# EasyEDA schematic SCH_Genie-V1_2024-08-01.json
TITLE: Sheet_1; REV: 1.0; Date: 2024-07-29; Sheet: 1/1; Drawn By: usedgenes; Company: Your Company
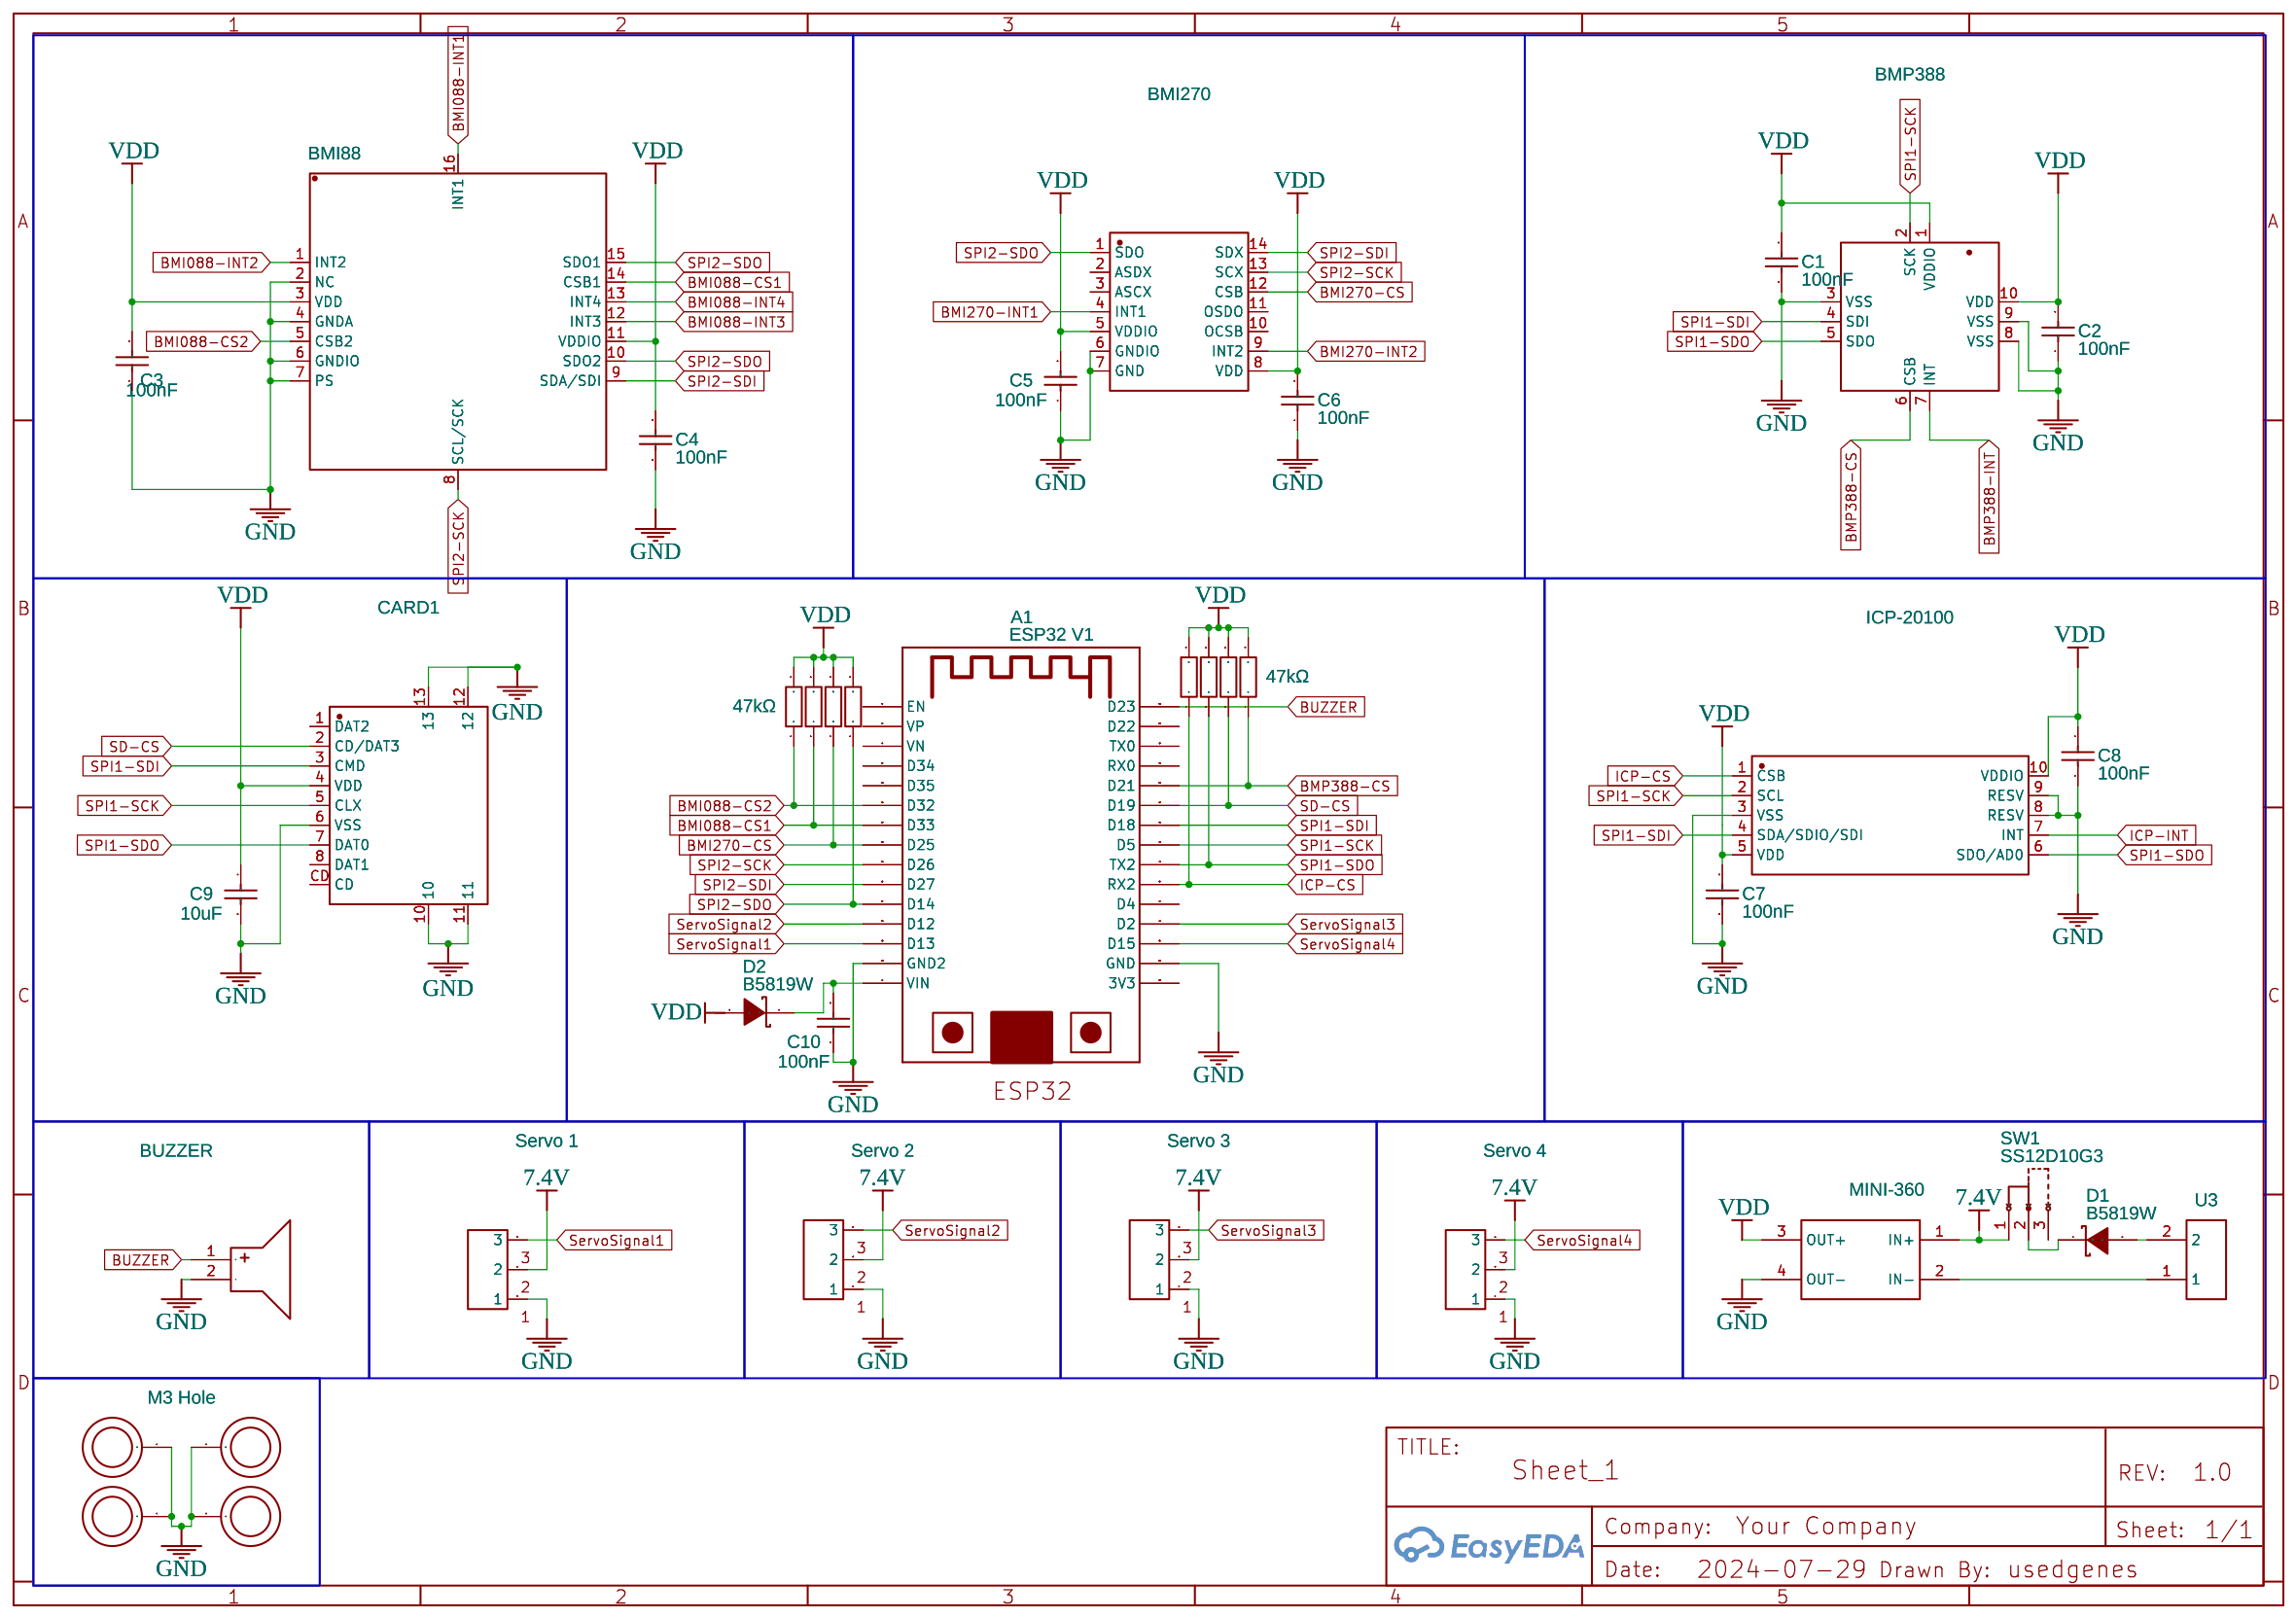
[diagram p0: schematic sheet]

## Parts
A1  ESP32 V1  [ESP32-DEVKITV1_ESP32-DEVKITV1]
BMI88  BMI088  [LGA-16_L4.5-W3.0-P0.50-BL]
BMI270  BMI270  [LGA-14_L3.0-W2.5-P0.50-BR]
BMP388  BMP388  [SENSORM-SMD_BMP388]
BUZZER  4000Hz  [BUZ-TH_BD14.0-P7.60-D1.0-L]
C1  100nF  [C0402]
C2  100nF  [C0402]
C3  100nF  [C0402]
C4  100nF  [C0402]
C5  100nF  [C0402]
C6  100nF  [C0402]
C7  100nF  [C0402]
C8  100nF  [C0402]
C9  10uF  [C0402]
C10  100nF  [C0402]
CARD1  TF PUSH  [TF-SMD_TF-PUSH]
D1  B5819W  [SOD-123_L2.8-W1.8-LS3.7-RD]
D2  B5819W  [SOD-123_L2.8-W1.8-LS3.7-RD]
H1  M3 Hole  [HOLEHOLE]
H2  3MM_HOLE  [HOLEHOLE]
H3  3MM_HOLE  [HOLEHOLE]
H4  3MM_HOLE  [HOLEHOLE]
ICP-20100  ICP-20100  [LGA-10_L2.0-W2.0-P0.50-TL_ICP-20100]
MINI-360  MINI-360  [DSN-MINI-360]
P1  Servo 1  [CONNECTOR_PINHEADER_2.54MM:PINHEADER_1X3]
P2  Servo 2  [CONNECTOR_PINHEADER_2.54MM:PINHEADER_1X3]
P3  Servo 3  [CONNECTOR_PINHEADER_2.54MM:PINHEADER_1X3]
P4  Servo 4  [CONNECTOR_PINHEADER_2.54MM:PINHEADER_1X3]
R1  47kΩ  [R0402]
R2  47kΩ  [R0402]
R3  47kΩ  [R0402]
R4  47kΩ  [R0402]
R5  47kΩ  [R0402]
R7  47kΩ  [R0402]
R8  47kΩ  [R0402]
R9  47kΩ  [R0402]
SW1  SS12D10G3  [SW-TH_3P-P4.8-L12.7-W6.7_SS12D10G3]
U3  Power Pins  [PIN HEADER CONNECTOR 1X2 PINS_PITCH 2.54MM]

## Library data of the parts
A1 = ESP32-DEVKIT-V1-30PIN: Contributor: Ростислав Максимов
BMI88 = BMI088: Contributor: LCSC; Supplier: LCSC; Supplier Part: C194919; Manufacturer: Bosch(博世); JLCPCB Part Class: Extended Part
BMI270 = BMI270: Contributor: LCSC; Supplier: LCSC; Supplier Part: C2836813; Manufacturer: Bosch(博世); JLCPCB Part Class: Extended Part
BMP388 = BMP388: Contributor: LCSC; Supplier: LCSC; Supplier Part: C779278; Manufacturer: Bosch(博世); JLCPCB Part Class: Extended Part
BUZZER = SKY-1475-0540-45P7.6: Contributor: LCSC; Supplier: LCSC; Supplier Part: C511707; Manufacturer: S&S(海旭); JLCPCB Part Class: Extended Part
C1-C8 C10 = CL05B104KO5NNNC: Supplier: LCSC; Manufacturer: SAMSUNG(三星); Supplier Part: C1525; JLCPCB Part Class: Basic Part
C9 = CL05A106MQ5NUNC: Supplier: LCSC; Manufacturer: SAMSUNG(三星); Supplier Part: C15525; JLCPCB Part Class: Basic Part
CARD1 = TF PUSH: Contributor: LCSC; Supplier: LCSC; Supplier Part: C393941; Manufacturer: SHOU HAN(首韩); JLCPCB Part Class: Extended Part
D1 D2 = B5819W: Supplier: LCSC; Manufacturer: MDD(辰达半导体); Supplier Part: C64885; JLCPCB Part Class: Extended Part
H1-H4 = 3MM_HOLE: Contributor: Cillié Malan
ICP-20100 = ICP-20100: Supplier: LCSC; Supplier Part: C5343527; Manufacturer: TDK; JLCPCB Part Class: Extended Part; Contributor: lcsc
MINI-360 = MINI-360: Contributor: RaspAutomacao
P1-P4 = HEADER PAD 3X RMM COPY: Supplier: LCSC; Manufacturer: BOOMELE; Manufacturer Part: Female headerHDR1X8-2.54; Supplier Part: C27438; JLCPCB Part Class: Extended Part; Contributor: blackhassio; Package Display: No
R1-R5 R7-R9 = 0402WGF4702TCE: Supplier: LCSC; Manufacturer: UNI-ROYAL(厚声); Supplier Part: C25792; JLCPCB Part Class: Basic Part
SW1 = SS12D10G3: Supplier: LCSC; Supplier Part: C7431053; Manufacturer: SHOU HAN(首韩); Contributor: lcsc
U3 = 1X2: Contributor: Ramsha

## Nets
7.4V: MINI-360.1(IN+) P1.2 P2.2 P3.2 P4.2 SW1.1
GND: A1.GND A1.GND2 BMI88.2(NC) BMI88.4(GNDA) BMI88.6(GNDIO) BMI88.7(PS) BMI270.6(GNDIO) BMI270.7(GND) BMP388.3(VSS) BMP388.8(VSS) BMP388.9(VSS) BUZZER.2(-) C1.1 C2.1 C3.1 C4.1 C5.1 C6.1 C7.1 C8.1 C9.2 C10.1 CARD1.6(VSS) CARD1.10 CARD1.11 CARD1.12 CARD1.13 H1.1 H2.1 H3.1 H4.1 ICP-20100.3(VSS) ICP-20100.8(RESV) ICP-20100.9(RESV) MINI-360.4(OUT-) P1.1 P2.1 P3.1 P4.1
VDD: BMI88.3(VDD) BMI88.11(VDDIO) BMI270.5(VDDIO) BMI270.8(VDD) BMP388.1(VDDIO) BMP388.10(VDD) C1.2 C2.2 C3.2 C4.2 C5.2 C6.2 C7.2 C8.2 C9.1 CARD1.4(VDD) D2.2(A) ICP-20100.5(VDD) ICP-20100.10(VDDIO) MINI-360.3(OUT+) R1.2 R2.2 R3.2 R4.2 R5.2 R7.2 R8.2 R9.2
BMI088-CS1: A1.D33 BMI88.14(CSB1) R1.1
BMI088-CS2: A1.D32 BMI88.5(CSB2) R4.1
BMI088-INT1: BMI88.16(INT1)
BMI088-INT2: BMI88.1(INT2)
BMI088-INT3: BMI88.12(INT3)
BMI088-INT4: BMI88.13(INT4)
BMI270-CS: A1.D25 BMI270.12(CSB) R2.1
BMI270-INT1: BMI270.4(INT1)
BMI270-INT2: BMI270.9(INT2)
BMP388-CS: A1.D21 BMP388.6(CSB) R5.1
BMP388-INT: BMP388.7(INT)
BUZZER: A1.D23 BUZZER.1(+)
ICP-CS: A1.RX2 ICP-20100.1(CSB) R8.1
ICP-INT: ICP-20100.7(INT)
SD-CS: A1.D19 CARD1.2(CD/DAT3) R7.1
ServoSignal1: A1.D13 P1.3
ServoSignal2: A1.D12 P2.3
ServoSignal3: A1.D2 P3.3
ServoSignal4: A1.D15 P4.3
SPI1-SCK: A1.D5 BMP388.2(SCK) CARD1.5(CLX) ICP-20100.2(SCL)
SPI1-SDI: A1.D18 BMP388.4(SDI) CARD1.3(CMD) ICP-20100.4(SDA/SDIO/SDI)
SPI1-SDO: A1.TX2 BMP388.5(SDO) CARD1.7(DAT0) ICP-20100.6(SDO/AD0) R9.1
SPI2-SCK: A1.D26 BMI88.8(SCL/SCK) BMI270.13(SCX)
SPI2-SDI: A1.D27 BMI88.9(SDA/SDI) BMI270.14(SDX)
SPI2-SDO: A1.D14 BMI88.10(SDO2) BMI88.15(SDO1) BMI270.1(SDO) R3.1
Net-(A1-VIN): A1.VIN C10.2 D2.1(K)
Net-(D1-1): D1.1(K) SW1.2
Net-(D1-2): D1.2(A) U3.2
Net-(MINI-360-2): MINI-360.2(IN-) U3.1

Not connected (* = marked no-connect by the designer): A1 3V3 D4 D22 D34 D35 EN RX0 TX0 VN VP; BMI270 2(ASDX) 3(ASCX) 10(OCSB) 11(OSDO); CARD1 1(DAT2) 8(DAT1) CD; SW1 3
